# EAGLE design OhEyeZero (EAGLE 6.2)
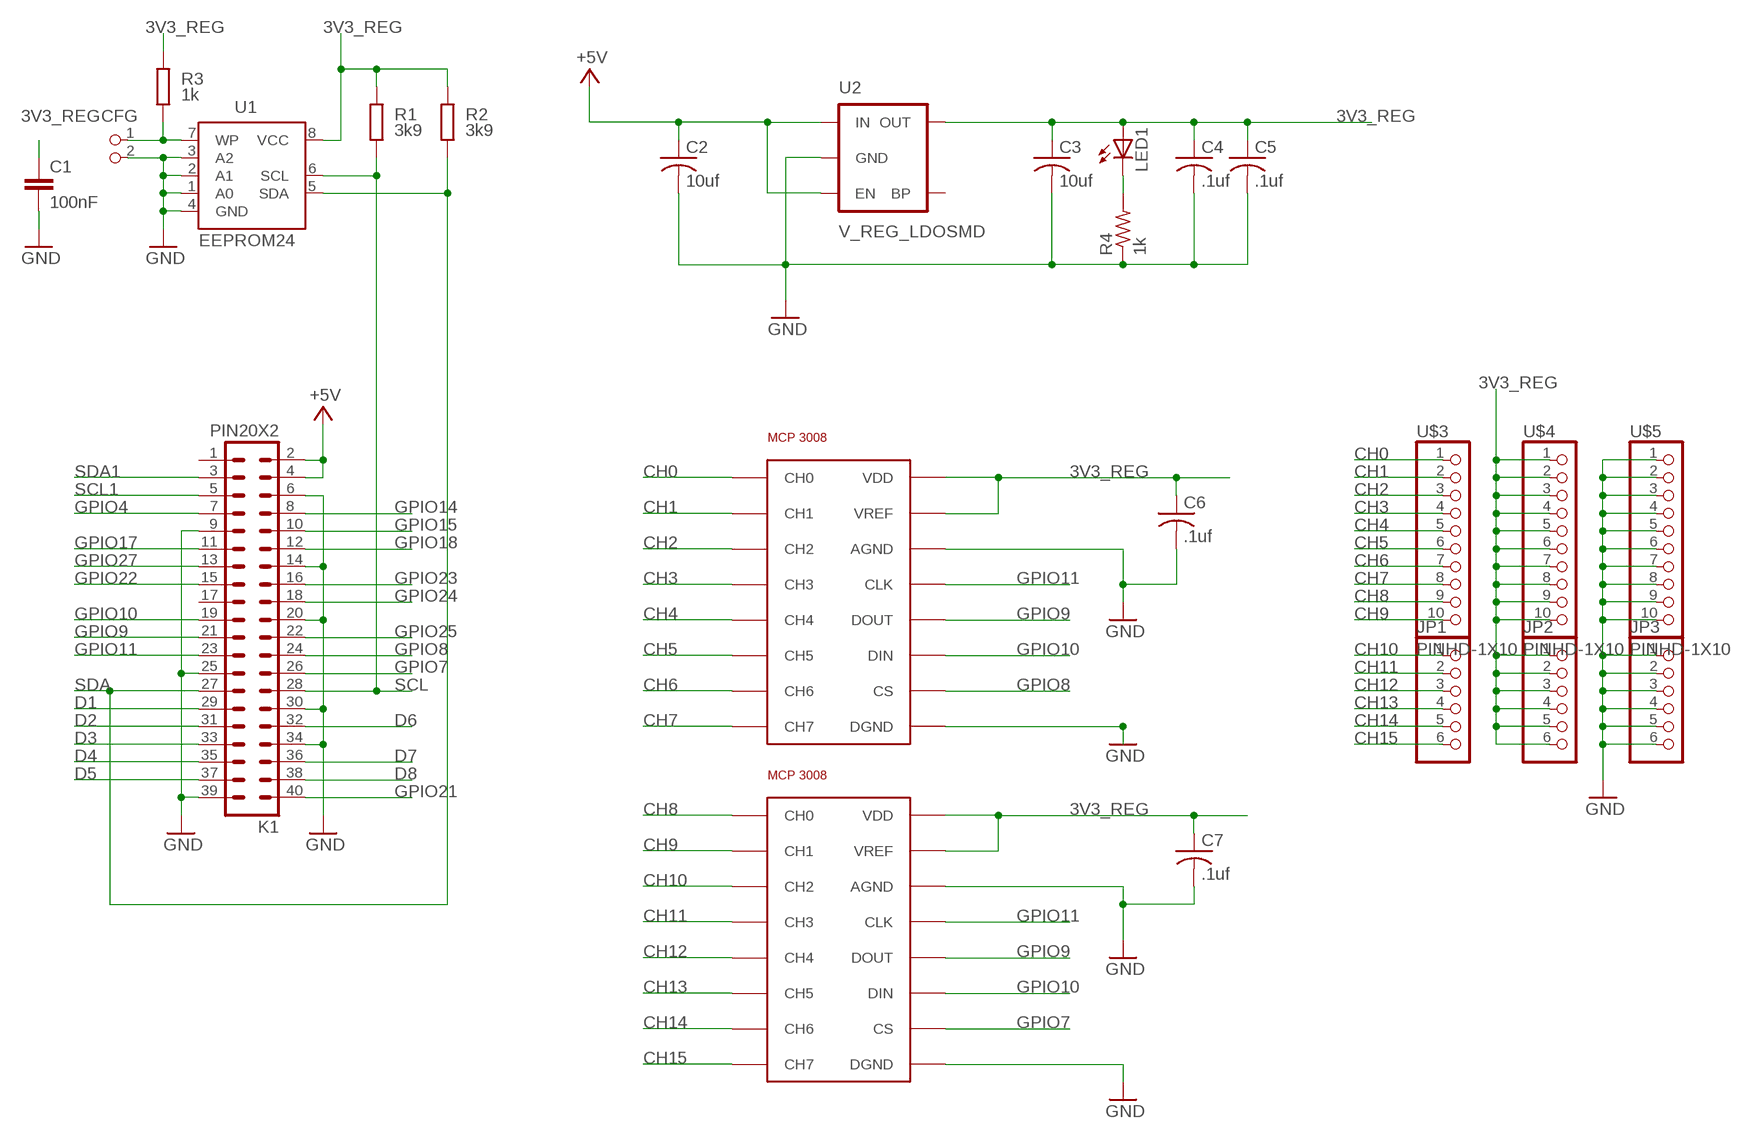
[diagram p0: schematic, sheet 1]

## Parts
C1  100nF  C-EUC0805K  [C0805K]
C2  10uf  C-USC0805K  [C0805K]
C3  10uf  C-USC0805K  [C0805K]
C4  .1uf  C-USC0805K  [C0805K]
C5  .1uf  C-USC0805K  [C0805K]
C6  .1uf  C-USC0805K  [C0805K]
C7  .1uf  C-USC0805K  [C0805K]
CFG  PIN2_100  [PIN_W_2]
JP1  PINHD-1X6B  [1X06-BIG]
JP2  PINHD-1X6B  [1X06-BIG]
JP3  PINHD-1X6B  [1X06-BIG]
K1  PIN20X2  [PIN_20X2]
LED1  LEDLED-0805  [LED0805.PAC]
R1  3k9  R-EU_M0805  [M0805]
R2  3k9  R-EU_M0805  [M0805]
R3  1k  R-EU_M0805  [M0805]
R4  1k  R-US_R0805W  [R0805W]
U1  EEPROM24  [SOIC8]
U2  V_REG_LDOSMD  [SOT23-5]
U$1  MCP3008_ADC  [SOIC16]
U$2  MCP3008_ADC  [SOIC16]
U$3  PINHD-1X10  [1X10-BIG]
U$4  PINHD-1X10  [1X10-BIG]
U$5  PINHD-1X10  [1X10-BIG]

## Nets
3V3_REG: C1.1 C3.1 C4.1 C5.1 C6.1 C7.1 JP2.1 JP2.2 JP2.3 JP2.4 JP2.5 JP2.6 LED1.A R1.2 R2.2 R3.2 U1.8(VCC) U2.5(OUT) U$1.P$15(VREF) U$1.P$16(VDD) U$2.P$15(VREF) U$2.P$16(VDD) U$4.1 U$4.2 U$4.3 U$4.4 U$4.5 U$4.6 U$4.7 U$4.8 U$4.9 U$4.10
+5V: C2.1 K1.2 K1.4 U2.1(IN) U2.3(EN)
CH0: U$1.P$1(CH0) U$3.1
CH1: U$1.P$2(CH1) U$3.2
CH2: U$1.P$3(CH2) U$3.3
CH3: U$1.P$4(CH3) U$3.4
CH4: U$1.P$5(CH4) U$3.5
CH5: U$1.P$6(CH5) U$3.6
CH6: U$1.P$7(CH6) U$3.7
CH7: U$1.P$8(CH7) U$3.8
CH8: U$2.P$1(CH0) U$3.9
CH9: U$2.P$2(CH1) U$3.10
CH10: JP1.1 U$2.P$3(CH2)
CH11: JP1.2 U$2.P$4(CH3)
CH12: JP1.3 U$2.P$5(CH4)
CH13: JP1.4 U$2.P$6(CH5)
CH14: JP1.5 U$2.P$7(CH6)
CH15: JP1.6 U$2.P$8(CH7)
D1: K1.29
D2: K1.31
D3: K1.33
D4: K1.35
D5: K1.37
D6: K1.32
D7: K1.36
D8: K1.38
GND: C1.2 C2.2 C3.2 C4.2 C5.2 C6.2 C7.2 CFG.2 JP3.1 JP3.2 JP3.3 JP3.4 JP3.5 JP3.6 K1.6 K1.9 K1.14 K1.20 K1.25 K1.30 K1.34 K1.39 R4.1 U1.1(A0) U1.2(A1) U1.3(A2) U1.4(GND) U2.2(GND) U$1.P$9(DGND) U$1.P$14(AGND) U$2.P$9(DGND) U$2.P$14(AGND) U$5.1 U$5.2 U$5.3 U$5.4 U$5.5 U$5.6 U$5.7 U$5.8 U$5.9 U$5.10
GPIO4: K1.7
GPIO7: K1.26 U$2.P$10(CS)
GPIO8: K1.24 U$1.P$10(CS)
GPIO9: K1.21 U$1.P$12(DOUT) U$2.P$12(DOUT)
GPIO10: K1.19 U$1.P$11(DIN) U$2.P$11(DIN)
GPIO11: K1.23 U$1.P$13(CLK) U$2.P$13(CLK)
GPIO14: K1.8
GPIO15: K1.10
GPIO17: K1.11
GPIO18: K1.12
GPIO21: K1.40
GPIO22: K1.15
GPIO23: K1.16
GPIO24: K1.18
GPIO25: K1.22
GPIO27: K1.13
N$3: CFG.1 R3.1 U1.7(WP)
N$8: LED1.K(C) R4.2
SCL: K1.28 R1.1 U1.6(SCL)
SCL1: K1.5
SDA: K1.27 R2.1 U1.5(SDA)
SDA1: K1.3
Unconnected: K1.1 K1.17 U2.4(BP)

## Library data of the parts
C1 = resistor:C-EU: CAPACITOR, European symbol; DIELECTRIC: X7R
C2-C7 = ModernDevice:C-US: CAPACITOR, American symbol
CFG = FLYFISH:PIN2
JP1-JP3 = adafruit:PINHD-1X6: PIN HEADER
K1 = FLYFISH:PIN20X2
LED1 = ModernDevice:LED: LEDs Standard schematic elements and footprints for 5mm, 3mm, 1206, and 0603 sized LEDs. 5mm - Spark Fun Electronics SKU : COM-00529 (and others)
R1-R3 = resistor:R-EU_: RESISTOR, European symbol; TOLERANCE: 5%
R4 = ModernDevice:R-US_: RESISTOR, American symbol
U1 = FLYFISH:EEPROM24
U2 = ModernDevice:V_REG_LDO: Voltage Regulator LDO Standard 150mA LDO voltage regulator in SOT-23 layout. Micrel part MIC5205. BP (by-pass) pin is used to lower output noise with 470pF cap.
U$1 U$2 = ModernDevice:MCP3008_ADC
U$3-U$5 = adafruit:PINHD-1X10: Pin header 1x10 0.1" spacing With round pins

## Board
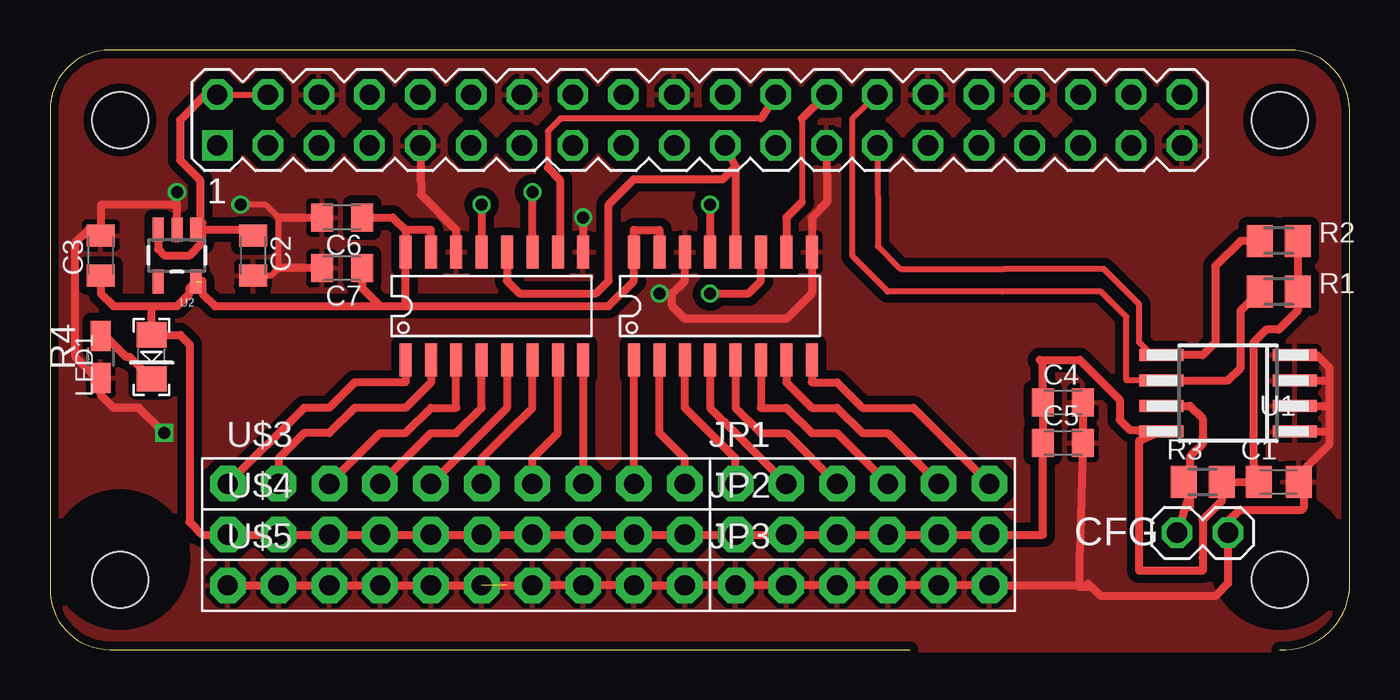
[diagram p1: board, top side]
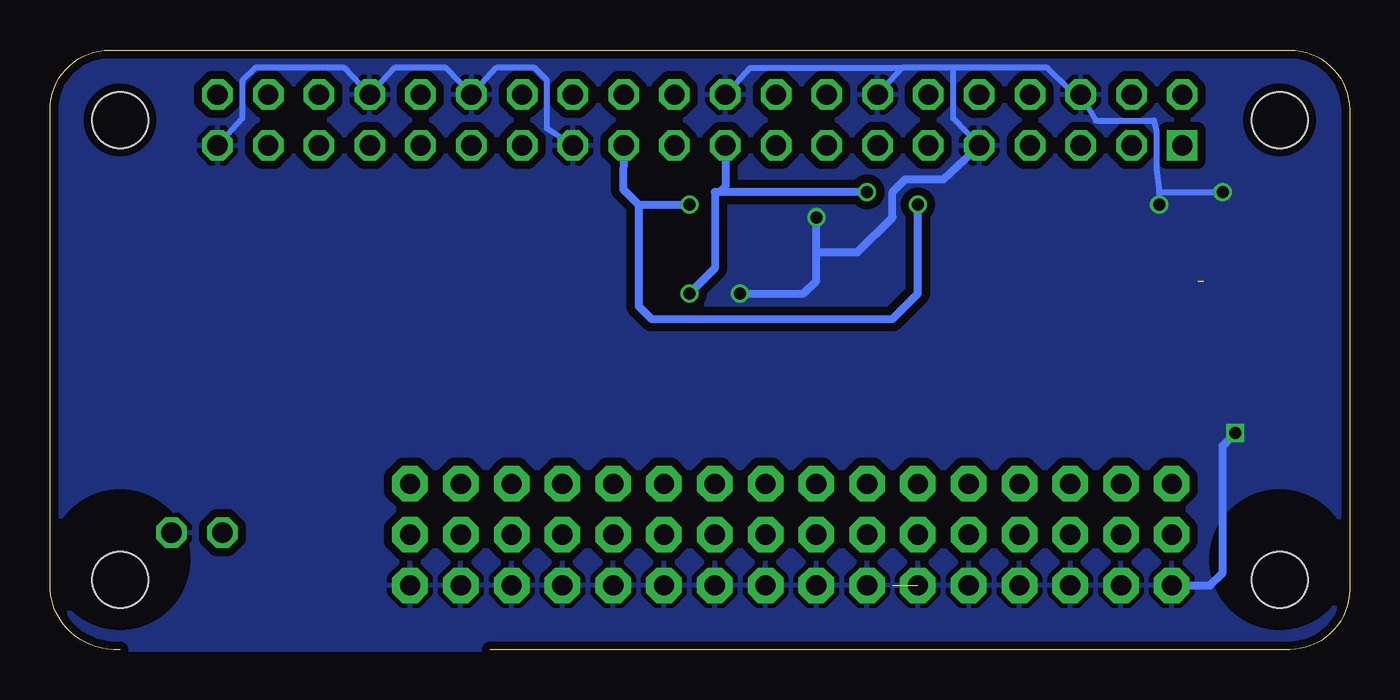
[diagram p2: board, bottom side, seen from below]

Size 65 x 30.01 mm. Coordinates in mm from the lower left corner, seen from the top.
Outline: 43,0.01 3,0.01 arc-90 0,3.01 0,19.51
Outline: 61.5,0.01 arc90 65,3.01 65,27.01 arc90 62,30.01 3,30.01 arc90 0,27.01 0,11.51
Copper layers (1*16): Top 0.035mm / dielectric 1.5mm / Bottom 0.035mm
Design rules: minimum track width 6mil, minimum drill 12mil, track to track 6mil, track to pad 6mil, pad to pad 6mil, via to via 6mil, smd to smd 0mil, copper to edge 10mil, drill to drill 10mil, minimum pad ring 10mil, minimum via ring 6mil, stop-mask expansion 10mil, vias tented up to drill 100mil, thermal gap 10mil
Holes 2.8 mm at 3.5,3.51 3.5,26.51 61.5,26.51 61.5,3.51
tRestrict: area 1.9,52 to 5,55.1; area 60,52 to 63,55.1; area 60,3 to 63,6.1; area 1.9,3 to 5,6.1
bRestrict: area 1.9,3 to 5,6.1; area 1.9,52 to 5,55.1; area 60,3 to 63,6.1; area 60,52 to 63,55.1

### Footprints (pad centres in the part's own frame; a part is rotated, then mirrored left to right if it is on the bottom)
C0805K = smd 1.3 x 1.6: 1 -1,0; 2 1,0
C0805K' = smd 1.1 x 1.4: 1 -1,0; 2 1,0
PIN_W_2 = drill 1.016 octagon: 1 0,0; 2 0,-2.54
1X06-BIG = drill 1.016 pad 1.778 octagon: 1 -6.35,0; 2 -3.81,0; 3 -1.27,0; 4 1.27,0; 5 3.81,0; 6 6.35,0
PIN_20X2 = drill 1.016 square: 1 -24.13,-1.27 | drill 1.016 octagon: 2 -24.13,1.27; 3 -21.59,-1.27; 4 -21.59,1.27; 5 -19.05,-1.27; 6 -19.05,1.27; 7 -16.51,-1.27; 8 -16.51,1.27; 9 -13.97,-1.27; 10 -13.97,1.27; 11 -11.43,-1.27; 12 -11.43,1.27; 13 -8.89,-1.27; 14 -8.89,1.27; 15 -6.35,-1.27; 16 -6.35,1.27; 17 -3.81,-1.27; 18 -3.81,1.27; 19 -1.27,-1.27; 20 -1.27,1.27; 21 1.27,-1.27; 22 1.27,1.27; 23 3.81,-1.27; 24 3.81,1.27; 25 6.35,-1.27; 26 6.35,1.27; 27 8.89,-1.27; 28 8.89,1.27; 29 11.43,-1.27; 30 11.43,1.27; 31 13.97,-1.27; 32 13.97,1.27; 33 16.51,-1.27; 34 16.51,1.27; 35 19.05,-1.27; 36 19.05,1.27; 37 21.59,-1.27; 38 21.59,1.27; 39 24.13,-1.27; 40 24.13,1.27
LED0805.PAC = smd 1.27 x 1.5: A 1.104,0; K -1.104,0
M0805 = smd 1.3 x 1.6: 1 -0.95,0; 2 0.95,0
R0805W = smd 1.5 x 1: 1 -1.052,0; 2 1.052,0
SOIC8 = smd 0.6 x 2.2: 1 -1.905,-3.33; 2 -0.635,-3.33; 3 0.635,-3.33; 4 1.905,-3.33; 5 1.905,3.33; 6 0.635,3.33; 7 -0.635,3.33; 8 -1.905,3.33
SOT23-5 = smd 0.55 x 1.2: 1 -0.95,-1.3; 2 0,-1.3; 3 0.95,-1.3; 4 0.95,1.3; 5 -0.95,1.3
SOIC16 = smd 1.65 x 0.6: P$1 -2.7,3.81; P$2 -2.7,2.54; P$3 -2.7,1.27; P$4 -2.7,0; P$5 -2.7,-1.27; P$6 -2.7,-2.54; P$7 -2.7,-3.81; P$8 -2.7,-5.08; P$9 2.7,-5.08; P$10 2.7,-3.81; P$11 2.7,-2.54; P$12 2.7,-1.27; P$13 2.7,0; P$14 2.7,1.27; P$15 2.7,2.54; P$16 2.7,3.81
1X10-BIG = drill 1.016 pad 1.778 octagon: 1 -11.43,0; 2 -8.89,0; 3 -6.35,0; 4 -3.81,0; 5 -1.27,0; 6 1.27,0; 7 3.81,0; 8 6.35,0; 9 8.89,0; 10 11.43,0

### Placement (x,y rotation side)
C1  61.46,8.39 0 top
C2  10uf  [C0805K']  10.16,19.73 270 top
C3  10uf  [C0805K']  2.54,19.73 90 top
C4  .1uf  [C0805K']  50.66,12.38 0 top
C5  .1uf  [C0805K']  50.66,10.34 0 top
C6  .1uf  [C0805K']  14.61,21.63 180 top
C7  .1uf  [C0805K']  14.61,19.09 180 top
CFG  56.38,5.85 90 top
JP1  40.64,8.3 0 top
JP2  40.64,5.76 0 top
JP3  40.64,3.22 0 top
K1  32.49,26.5 0 top
LED1  5.08,14.65 90 top
R1  61.46,17.92 0 top
R2  61.46,20.46 0 top
R3  57.65,8.39 0 top
R4  2.54,14.65 90 top
U1  58.92,12.84 90 top
U2  6.35,19.73 180 top
U$1  21.59,17.19 90 top
U$2  33.02,17.19 90 top
U$3  20.32,8.3 0 top
U$4  20.32,5.76 0 top
U$5  20.32,3.22 0 top

### Tracks (layer width: path | path; a pad name or v marks a point on that pad's centre or on a via)
3V3_REG  (1 unrouted)
  Top 0.406: C3.1 2.54,17.82 3.17,17.19 5.08,17.19 | 5.08,17.19 6.35,17.19 6.99,17.82 6.99,18.11 U2.5 | LED1.A 5.08,15.92 | 5.08,15.92 5.08,17.19 | LED1.A 5.08,15.92 | 7.59,18.43 7.62,18.46 7.62,17.82 8.26,17.19 16.51,17.19 | 16.51,17.19 17.78,17.19 | 17.78,17.19 27.94,17.19 29.21,18.46 U$2.P$16 29.21,21 30.48,21 U$2.P$15 | 54.48,10.93 U1.8 | U1.8 54.48,10.45 54.48,5.85 54.48,3.95 57.65,3.95 57.65,4.58 57.65,6.49 58.28,7.12 58.6,7.44 R3.2 C1.1 60.19,9.3 60.19,15.38 60.83,16.01 61.46,16.01 62.41,16.96 R1.2 R2.2 | LED1.A 6.52,15.75 6.99,15.28 6.99,6.39 7.62,5.76 U$4.1 U$4.2 U$4.3 U$4.4 U$4.5 U$4.6 U$4.7 U$4.8 U$4.9 U$4.10 JP2.1 JP2.2 JP2.3 JP2.4 JP2.5 JP2.6 49.66,5.76 C5.1 C4.1 49.66,14.34 49.5,14.51 51.5,14.51 53.5,12.51 53.5,11.51 54,11.01 56.5,11.01 55.66,11.01 U1.8 | U$1.P$15 19.05,20.36 19.05,21 17.78,21 | 17.78,21 U$1.P$16 17.78,17.19 | C6.1 17.14,21.63 17.78,21 | C7.1 15.61,18.09 16.51,17.19
+5V
  Top 0.305: K1.2 K1.4
  Top 0.406: 7.62,21.35 U2.1 | U2.1 9.86,21.03 C2.1 | U2.3 5.4,20.04 5.71,19.73 6.99,19.73 7.62,20.36 7.62,20.71 U2.1 | K1.2 7.76,27.77 6.5,26.51 6.5,24.51 7.5,23.51 7.5,21.23 U2.1
CH0
  Top 0.406: U$1.P$1 17.78,13.38 15.24,13.38 13.97,12.11 12.7,12.11 U$3.1
CH1
  Top 0.406: U$1.P$2 19.05,13.38 17.78,12.11 15.24,12.11 13.97,10.84 12.7,10.84 11.43,9.57 U$3.2
CH2
  Top 0.406: U$3.3 16.51,10.84 17.78,10.84 19.05,12.11 20.32,12.11 U$1.P$3
CH3
  Top 0.406: U$3.4 19.05,10.84 20.32,10.84 21.59,12.11 U$1.P$4
CH4
  Top 0.406: U$1.P$5 22.86,12.11 U$3.5
CH5
  Top 0.406: U$3.6 21.59,9.57 22.86,10.84 24.13,12.11 U$1.P$6
CH6
  Top 0.406: U$3.7 24.13,9.57 25.4,10.84 U$1.P$7
CH7
  Top 0.406: U$1.P$8 U$3.8
CH8
  Top 0.406: U$3.9 U$2.P$1
CH9
  Top 0.406: U$3.10 31.75,9.57 30.48,10.84 U$2.P$2
CH10
  Top 0.406: JP1.1 34.29,9.57 31.75,12.11 U$2.P$3
CH11
  Top 0.406: U$2.P$4 33.02,12.11 34.29,10.84 JP1.2
CH12
  Top 0.406: U$2.P$5 34.29,12.11 35.56,10.84 36.83,10.84 JP1.3
CH13
  Top 0.406: U$2.P$6 35.56,12.11 36.83,12.11 38.1,10.84 39.37,10.84 JP1.4
CH14
  Top 0.406: U$2.P$7 36.83,13.38 38.1,12.11 39.37,12.11 40.64,10.84 41.91,10.84 JP1.5
CH15
  Top 0.406: U$2.P$8 38.1,13.38 39.37,13.38 40.64,12.11 43.18,12.11 JP1.6
GND  (via drill 0.6)  (1 unrouted)
  Top 0.305: v6.35,22.9 6.35,22.27 | C2.2 11.06,18.73 11.43,19.09 11.43,21.63 10.79,22.27 v9.53,22.27
  Top 0.406: U$5.1 U$5.2 U$5.3 U$5.4 U$5.5 22.86,3.22 U$5.7 U$5.8 U$5.9 U$5.10 JP3.1 JP3.2 JP3.3 JP3.4 JP3.5 JP3.6 51.94,3.22 51.94,3.31 52.12,3.13 | K1.9 18.55,22.77 20.32,21 U$1.P$14 20.32,19.73 | U2.2 6.35,22.27 2.54,22.27 C3.2 2.27,21 1.91,21 1.27,20.36 1.27,14.65 2.32,13.6 R4.1 2.54,12.74 3.17,12.11 4.45,12.11 v5.71,10.84 | K1.25 38.87,22.4 38.1,21.63 U$2.P$9 38.1,17.82 36.83,16.55 31.75,16.55 31.11,17.19 31.11,17.82 | 31.11,17.82 31.75,18.46 31.75,19.73 | 31.75,19.73 U$2.P$14 31.75,19.73 | 64,10.93 64,10.3 62.73,9.03 C1.2 62.73,8.12 62.73,7.12 62.62,7.01 59.5,7.01 58.92,6.43 CFG.2 58.92,3.31 58.28,2.68 52.57,2.68 52.12,3.13 | 64,10.93 64,12.2 | 64,12.2 64,13.47 | 64,13.47 64,14.11 63.37,14.74 U1.4 | U1.3 64,13.47 | U1.2 64,12.2 | U1.1 64,10.93 | 31.11,17.82 v30.48,17.82 | v26.67,21.63 U$1.P$9 | C7.2 11.43,19.09 | 11.43,21.63 C6.2 | C4.2 C5.2 51.5,4.84 51.5,3.13 52.12,3.13
  Bottom 0.305: K1.39 55.38,26.58 55.38,28.48 54.74,29.12 50.3,29.12 K1.34 47.76,29.12 45.22,29.12 K1.30 42.68,29.12 40.77,29.12 40.14,28.48 40.14,26.08 K1.25 | 19.82,29.12 15.11,29.12 13.97,27.98 K1.6 12.69,26.48 9.79,26.48 9.66,25.94 9.66,24.04 9.53,22.9 | 19.82,29.12 22.36,29.12 | 22.36,29.12 K1.14 | K1.20 29.98,29.12 22.36,29.12 | K1.9 19.82,26.58 19.82,29.12 | 9.53,22.9 v6.35,22.9 | v9.53,22.27 9.53,22.9
  Bottom 0.406: U$5.1 6.99,3.22 6.35,3.85 6.35,10.2 v5.71,10.84 | v30.48,17.82 27.3,17.82 26.67,18.46 U$1.P$9 | U$1.P$9 v26.67,21.63 | U$1.P$9 24.61,19.89 22.86,21.63 22.86,22.9 22.23,23.54 20.32,23.54 K1.9
  pour Bottom (isolate 0.406): 0,3.01 arc90 2.5,0.01 61.5,0.01 arc90 65,3.01 65,27.01 arc90 62,30.01 3,30.01 arc90 0,27.01
  pour Top (isolate 0.406): 0,3.01 arc90 3,0.01 62,0.01 arc90 65,3.01 65,27.01 arc90 62,30.01 3,30.01 arc90 0,26.51
GPIO7
  Top 0.305: 37.6,26.58 37.6,22.4
  Top 0.406: K1.26 37.6,26.58 | 37.6,22.4 36.83,21.63 U$2.P$10
GPIO8
  Top 0.305: 35.56,26.58 25.54,26.58 24.9,25.94 24.9,24.11
  Top 0.406: K1.24 35.56,26.58 | 24.9,24.11 25.5,23.51 25.5,19.99 U$1.P$10
GPIO9
  Top 0.406: K1.21 34.29,24.17 | 34.29,24.17 34.29,20.36 | 34.29,20.36 U$2.P$12 34.29,20.36 | U$1.P$12 22.86,18.46 23.5,17.82 27.3,17.82 27.94,18.46 27.94,22.27 29.21,23.54 33.66,23.54 34.29,24.17
GPIO10  (via drill 0.6)
  Top 0.406: v33.02,17.82 34.92,17.82 35.56,18.46 U$2.P$11 | U$1.P$11 v24.13,22.9
  Bottom 0.406: v33.02,17.82 31.75,19.09 31.75,22.9 31.5,22.9 | v24.13,22.9 31.11,22.9 31.5,22.9 | K1.19 31.23,23.18 31.5,22.9
GPIO11  (via drill 0.6)
  Top 0.406: v33.02,22.27 U$2.P$13 33.02,19.73 | v21.59,22.27 U$1.P$13
  Bottom 0.406: 35.56,22.27 36.33,23.04 K1.23 | 35.56,22.27 35.56,17.19 34.92,16.55 22.86,16.55 21.59,17.82 v21.59,22.27 | 35.56,22.27 v33.02,22.27
N$3
  Top 0.406: CFG.1 57.02,7.76 | 57.02,7.76 57.02,7.12 57.02,7.76 | 57.02,7.76 57.02,8.71 R3.1 57.02,8.71 57.02,9.66 57.65,10.3 57.65,10.61 57.65,11.57 57.02,12.2 U1.7
N$8
  Top 0.406: R4.2 2.76,15.7 3.81,14.65 3.98,14.65 LED1.K
SCL
  Top 0.305: U1.6 53.84,13.47 53.84,16.65 52.57,17.92 47.62,17.92 41.91,17.92 40.14,19.69 40.14,26.58 K1.28
  Top 0.406: U1.6 58.92,13.47 59.55,14.11 59.55,16.96 R1.1
SDA
  Top 0.305: U1.5 55.11,14.74 54.48,15.38 54.48,17.28 52.7,19.05 47.76,19.05 42.55,19.05 41.41,20.19 K1.27
  Top 0.406: R2.1 59.55,20.46 58.28,19.19 58.28,15.38 57.65,14.74 U1.5

### Text on the board
bStop: www.fluxly.com/oheye.html